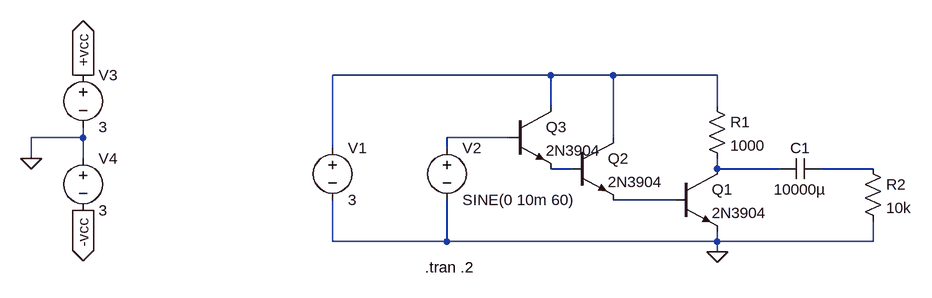
[diagram p0: schematic Voltage_detector.asc]
Voltage_detector.asc, the LTspice schematic file:
Version 4
SHEET 1 944 680
WIRE 32 64 -304 64
WIRE 128 64 32 64
WIRE 288 64 128 64
WIRE 32 112 32 64
WIRE 288 112 288 64
WIRE -688 160 -688 144
WIRE -688 160 -768 160
WIRE -32 160 -128 160
WIRE 128 160 128 64
WIRE -304 176 -304 64
WIRE -128 176 -128 160
WIRE -768 192 -768 160
WIRE -688 192 -688 160
WIRE 64 208 32 208
WIRE 288 208 288 192
WIRE 384 208 288 208
WIRE 528 208 448 208
WIRE 224 256 128 256
WIRE -304 320 -304 256
WIRE -128 320 -128 256
WIRE -128 320 -304 320
WIRE 288 320 288 304
WIRE 288 320 -128 320
WIRE 528 320 528 288
WIRE 528 320 288 320
WIRE 288 336 288 320
FLAG 288 336 0
FLAG -768 192 0
FLAG -688 64 +vcc
IOPIN -688 64 Out
FLAG -688 272 -vcc
IOPIN -688 272 Out
SYMBOL npn 224 208 R0
SYMATTR InstName Q1
SYMATTR Value 2N3904
SYMBOL npn -32 112 R0
SYMATTR InstName Q3
SYMATTR Value 2N3904
SYMBOL voltage -304 160 R0
WINDOW 123 0 0 Left 2
WINDOW 39 0 0 Left 2
SYMATTR InstName V1
SYMATTR Value 3
SYMBOL voltage -128 160 R0
WINDOW 123 0 0 Left 2
WINDOW 39 0 0 Left 2
SYMATTR InstName V2
SYMATTR Value SINE(0 10m 60)
SYMBOL res 272 96 R0
SYMATTR InstName R1
SYMATTR Value 1000
SYMBOL npn 64 160 R0
SYMATTR InstName Q2
SYMATTR Value 2N3904
SYMBOL cap 448 192 R90
WINDOW 0 0 32 VBottom 2
WINDOW 3 32 32 VTop 2
SYMATTR InstName C1
SYMATTR Value 10000µ
SYMBOL res 512 192 R0
SYMATTR InstName R2
SYMATTR Value 10k
SYMBOL voltage -688 48 R0
WINDOW 123 0 0 Left 2
WINDOW 39 0 0 Left 2
SYMATTR InstName V3
SYMATTR Value 3
SYMBOL voltage -688 176 R0
WINDOW 123 0 0 Left 2
WINDOW 39 0 0 Left 2
SYMATTR InstName V4
SYMATTR Value 3
TEXT -162 360 Left 2 !.tran .2

The netlist it stands for:
* Voltage_detector.asc
Q1 N004 N006 0 0 2N3904
Q3 N001 N002 N003 0 2N3904
V1 N001 0 3
V2 N002 0 SINE(0 10m 60)
R1 N001 N004 1000
Q2 N001 N003 N006 0 2N3904
C1 N005 N004 10000µ
R2 N005 0 10k
V3 +vcc 0 3
V4 0 -vcc 3
.model NPN NPN
.model PNP PNP
.lib standard.bjt
.tran .2
.backanno
.end